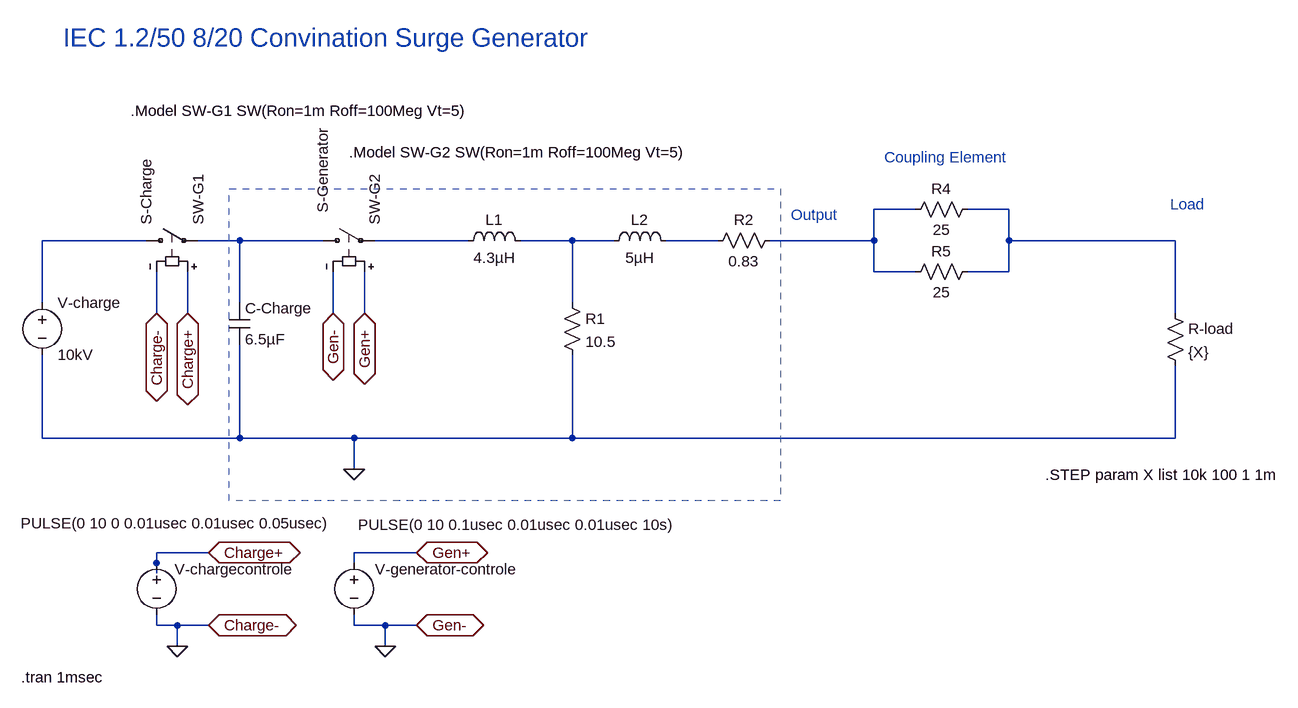
[diagram p0: schematic IEC-Convination1250loadstep.asc]
IEC-Convination1250loadstep.asc, the LTspice schematic file:
Version 4
SHEET 1 1220 720
WIRE 640 -16 576 -16
WIRE 784 -16 720 -16
WIRE -544 32 -704 32
WIRE -400 32 -464 32
WIRE -272 32 -400 32
WIRE -48 32 -192 32
WIRE 112 32 32 32
WIRE 176 32 112 32
WIRE 336 32 256 32
WIRE 576 32 576 -16
WIRE 576 32 416 32
WIRE 784 32 784 -16
WIRE 1040 32 784 32
WIRE 576 80 576 32
WIRE 640 80 576 80
WIRE 784 80 784 32
WIRE 784 80 720 80
WIRE -704 128 -704 32
WIRE -400 128 -400 32
WIRE 112 128 112 32
WIRE -528 144 -528 80
WIRE -480 144 -480 80
WIRE -256 144 -256 80
WIRE -208 144 -208 80
WIRE 1040 144 1040 32
WIRE -704 336 -704 208
WIRE -400 336 -400 192
WIRE -400 336 -704 336
WIRE -224 336 -400 336
WIRE 112 336 112 208
WIRE 112 336 -224 336
WIRE 1040 336 1040 224
WIRE 1040 336 112 336
WIRE -224 384 -224 336
WIRE -448 512 -528 512
WIRE -128 512 -224 512
WIRE -528 528 -528 512
WIRE -224 528 -224 512
WIRE -528 544 -528 528
WIRE -528 624 -528 608
WIRE -496 624 -528 624
WIRE -448 624 -496 624
WIRE -224 624 -224 608
WIRE -176 624 -224 624
WIRE -128 624 -176 624
WIRE -496 656 -496 624
WIRE -176 656 -176 624
FLAG -224 384 0
FLAG -208 144 Gen+
IOPIN -208 144 BiDir
FLAG -256 144 Gen-
IOPIN -256 144 BiDir
FLAG -128 512 Gen+
IOPIN -128 512 BiDir
FLAG -128 624 Gen-
IOPIN -128 624 BiDir
FLAG -448 512 Charge+
IOPIN -448 512 BiDir
FLAG -448 624 Charge-
IOPIN -448 624 BiDir
FLAG -480 144 Charge+
IOPIN -480 144 BiDir
FLAG -528 144 Charge-
IOPIN -528 144 BiDir
FLAG -496 656 0
FLAG -176 656 0
SYMBOL res 736 -32 R90
WINDOW 0 0 56 VBottom 2
WINDOW 3 32 56 VTop 2
SYMATTR InstName R4
SYMATTR Value 25
SYMBOL res 736 64 R90
WINDOW 0 0 56 VBottom 2
WINDOW 3 32 56 VTop 2
SYMATTR InstName R5
SYMATTR Value 25
SYMBOL cap -416 128 R0
SYMATTR InstName C-Charge
SYMATTR Value 6.5µF
SYMBOL voltage -704 112 R0
WINDOW 123 0 0 Left 0
WINDOW 39 0 0 Left 0
SYMATTR InstName V-charge
SYMATTR Value 10kV
SYMBOL res 1024 128 R0
SYMATTR InstName R-load
SYMATTR Value {X}
SYMBOL sw -288 32 R270
WINDOW 0 42 16 Left 2
SYMATTR InstName S-Generator
SYMATTR Value SW-G2
SYMBOL sw -560 32 R270
SYMATTR InstName S-Charge
SYMATTR Value SW-G1
SYMBOL voltage -528 512 R0
WINDOW 0 28 26 Left 2
WINDOW 3 -209 -45 Left 2
WINDOW 123 0 0 Left 0
WINDOW 39 0 0 Left 0
SYMATTR InstName V-chargecontrole
SYMATTR Value PULSE(0 10 0 0.01usec 0.01usec 0.05usec)
SYMBOL voltage -224 512 R0
WINDOW 0 32 26 Left 2
WINDOW 3 6 -43 Left 2
WINDOW 123 0 0 Left 0
WINDOW 39 0 0 Left 0
SYMATTR InstName V-generator-controle
SYMATTR Value PULSE(0 10 0.1usec 0.01usec 0.01usec 10s)
SYMBOL ind -64 48 R270
WINDOW 0 32 56 VTop 2
WINDOW 3 5 56 VBottom 2
SYMATTR InstName L1
SYMATTR Value 4.3µH
SYMBOL res 96 112 R0
SYMATTR InstName R1
SYMATTR Value 10.5
SYMBOL res 432 16 R90
WINDOW 0 0 56 VBottom 2
WINDOW 3 32 56 VTop 2
SYMATTR InstName R2
SYMATTR Value 0.83
SYMBOL ind 160 48 R270
WINDOW 0 32 56 VTop 2
WINDOW 3 5 56 VBottom 2
SYMATTR InstName L2
SYMATTR Value 5µH
TEXT -672 -280 Left 4 ;IEC 1.2/50 8/20 Convination Surge Generator
TEXT 448 -8 Left 2 ;Output
TEXT 1032 -24 Left 2 ;Load
TEXT -736 704 Left 2 !.tran 1msec
TEXT -568 -168 Left 2 !.Model SW-G1 SW(Ron=1m Roff=100Meg Vt=5)
TEXT -232 -104 Left 2 !.Model SW-G2 SW(Ron=1m Roff=100Meg Vt=5)
TEXT 592 -96 Left 2 ;Coupling Element
TEXT 840 392 Left 2 !.STEP param X list 10k 100 1 1m
RECTANGLE Normal -416 0 -416 0 2
RECTANGLE Normal 432 432 -416 -48 2

The netlist it stands for:
* IEC-Convination1250loadstep.asc
R4 N002 N001 25
R5 N002 N001 25
C-Charge N004 0 6.5µF
V-charge N003 0 10kV
R-load N002 0 {X}
S-Generator N004 N005 Gen+ 0 SW-G2
S-Charge N003 N004 Charge+ 0 SW-G1
V-chargecontrole Charge+ 0 PULSE(0 10 0 0.01usec 0.01usec 0.05usec)
V-generator-controle Gen+ 0 PULSE(0 10 0.1usec 0.01usec 0.01usec 10s)
L1 N005 N006 4.3µH
R1 N006 0 10.5
R2 N001 N007 0.83
L2 N006 N007 5µH
* IEC 1.2/50 8/20 Convination Surge Generator
* Output
* Load
.tran 1msec
.Model SW-G1 SW(Ron=1m Roff=100Meg Vt=5)
.Model SW-G2 SW(Ron=1m Roff=100Meg Vt=5)
* Coupling Element
.STEP param X list 10k 100 1 1m
.backanno
.end